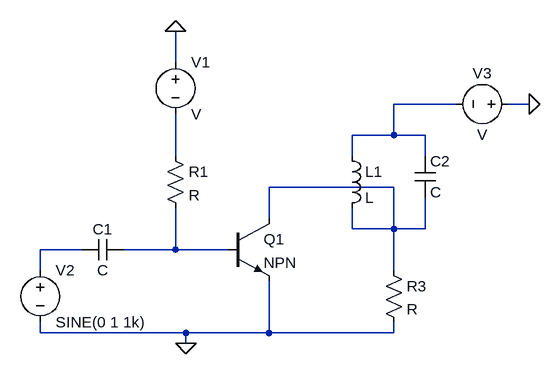
[diagram p0: schematic Draft1.asc]
Draft1.asc, the LTspice schematic file:
Version 4
SHEET 1 880 680
WIRE -272 -288 -272 -336
WIRE 160 -224 64 -224
WIRE 272 -224 240 -224
WIRE 64 -176 64 -224
WIRE 64 -176 0 -176
WIRE 112 -176 64 -176
WIRE -272 -144 -272 -208
WIRE 0 -144 0 -176
WIRE 112 -144 112 -176
WIRE 64 -96 -128 -96
WIRE -128 -48 -128 -96
WIRE 0 -32 0 -64
WIRE 64 -32 64 -96
WIRE 64 -32 0 -32
WIRE 112 -32 112 -80
WIRE 112 -32 64 -32
WIRE -416 0 -480 0
WIRE -272 0 -272 -64
WIRE -272 0 -352 0
WIRE -192 0 -272 0
WIRE -480 32 -480 0
WIRE 64 32 64 -32
WIRE -480 128 -480 112
WIRE -256 128 -480 128
WIRE -128 128 -128 48
WIRE -128 128 -256 128
WIRE 64 128 64 112
WIRE 64 128 -128 128
WIRE -256 144 -256 128
FLAG -256 144 0
FLAG -272 -336 0
FLAG 272 -224 0
SYMBOL res -288 -160 R0
SYMATTR InstName R1
SYMBOL cap -352 -16 R90
WINDOW 0 0 32 VBottom 2
WINDOW 3 32 32 VTop 2
SYMATTR InstName C1
SYMBOL voltage -272 -304 R0
SYMATTR InstName V1
SYMBOL npn -192 -48 R0
SYMATTR InstName Q1
SYMBOL ind -16 -160 R0
SYMATTR InstName L1
SYMBOL res 48 16 R0
SYMATTR InstName R3
SYMBOL cap 96 -144 R0
SYMATTR InstName C2
SYMBOL voltage 256 -224 R90
WINDOW 0 -32 56 VBottom 2
WINDOW 3 32 56 VTop 2
SYMATTR InstName V3
SYMBOL voltage -480 16 R0
WINDOW 123 0 0 Left 0
WINDOW 39 0 0 Left 0
SYMATTR InstName V2
SYMATTR Value SINE(0 1 1k)

The netlist it stands for:
* Draft1.asc
R1 N002 N005 R
C1 N005 N004 C
V1 0 N002 V
Q1 N003 N005 0 0 NPN
L1 N001 N003 L
R3 N003 0 R
C2 N001 N003 C
V3 0 N001 V
V2 N004 0 SINE(0 1 1k)
.model NPN NPN
.model PNP PNP
.lib standard.bjt
.backanno
.end